# Altium schematic sheet Mainboard_V1.0_Input.SchDoc: Mainboard
size A4; PageSetup: Record=PageOptions|CenterHorizontal=True|CenterVertical=True|PrintScale=0.97|XCorrection=1.00|YCorrection=1.00|PrintKind=0|BorderSize=5000000|LeftOffset=0|BottomOffset=0|Orientation=2|PaperLength=1000|PaperWidth=1000|Scale=100|PaperSource=7|PrintQuality=-3|MediaType=1|DitherType=10|PrintScaleMode=1|PaperKind=A4|PaperIndex=9; Organization: Ostschweizer Fachhochschule; Address2: Florian Baumgartner & Thierry Schwaller; Address3: florian.baumgartner@ost.ch; DocumentNumber: 3; Revision: V1.0; SheetNumber: 3; SheetTotal: 7; Author: Florian Baumgartner & Alain Keller; Subtitle: PDM-Microphone Input
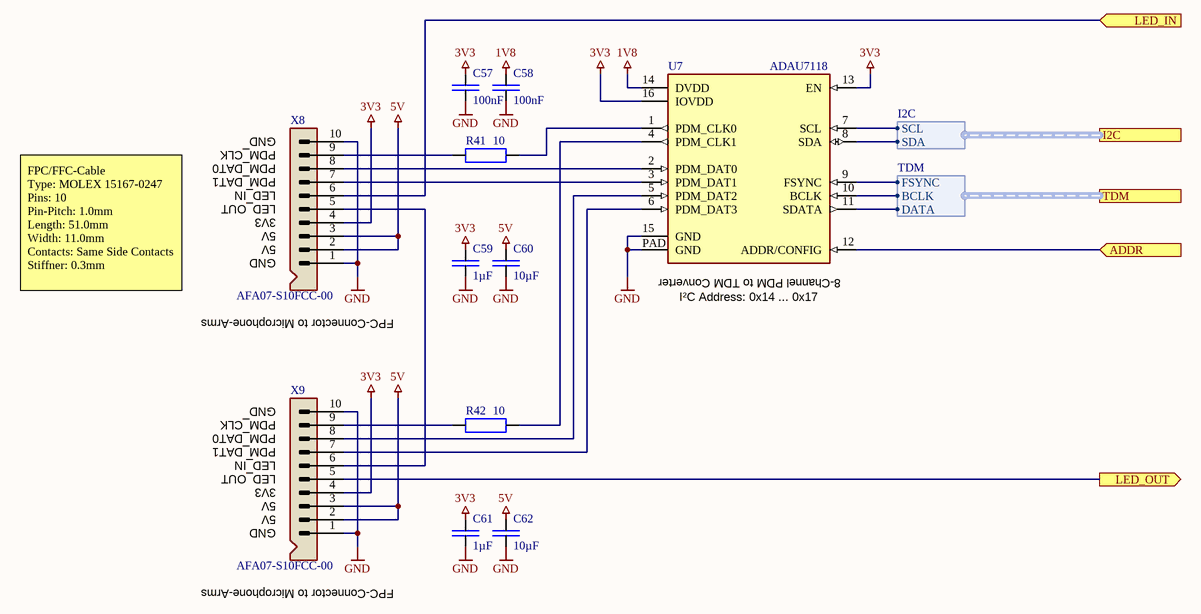
[diagram p0: Mainboard_V1.0_Input.SchDoc]

## Parts
C57  100nF  [SMD Keramikkondensator 0603]
C58  100nF  [SMD Keramikkondensator 0603]
C59  1µF  [SMD Keramikkondensator 0603]
C60  10µF  [SMD Keramikkondensator 1206]
C61  1µF  [SMD Keramikkondensator 0603]
C62  10µF  [SMD Keramikkondensator 1206]
R41  10  [SMD Widerstand 0603]
R42  10  [SMD Widerstand 0603]
U7  ADAU7118  [SMD IC QFN-16]
X8  AFA07-S10FCC-00  [SMD Connector (AFA07-S10FCC-00)]
X9  AFA07-S10FCC-00  [SMD Connector (AFA07-S10FCC-00)]

## Ports
ADDR (in), I2C (harness I2C), LED_IN (in), LED_OUT (out), TDM (harness TDM)

## Harnesses
TDM: BCLK, FSYNC, DATA
I2C: SCL, SDA

## Nets
1V8: C58.2 U7.14(DVDD)
3V3: C57.2 C59.2 C61.2 U7.13(EN) U7.16(IOVDD) X8.4 X9.4
5V: C60.2 C62.2 X8.2 X8.3 X9.2 X9.3
GND: C57.1 C58.1 C59.1 C60.1 C61.1 C62.1 U7.15(GND) U7.PAD(GND) X8.1 X8.10 X9.1 X9.10
ADDR: U7.12(ADDR/CONFIG) ; port ADDR
LED_IN: X8.6 ; port LED_IN
LED_OUT: X9.5 ; port LED_OUT
NetR41_1: R41.1 U7.1(PDM_CLK0)
NetR41_2: R41.2 X8.9
NetR42_1: R42.1 U7.4(PDM_CLK1)
NetR42_2: R42.2 X9.9
NetU7_2: U7.2(PDM_DAT0) X8.8
NetU7_3: U7.3(PDM_DAT1) X8.7
NetU7_5: U7.5(PDM_DAT2) X9.8
NetU7_6: U7.6(PDM_DAT3) X9.7
NetU7_7: U7.7(SCL) ; port I2C.SCL
NetU7_8: U7.8(SDA) ; port I2C.SDA
NetU7_9: U7.9(NC) ; port TDM.FSYNC
NetU7_10: U7.10(NC) ; port TDM.BCLK
NetU7_11: U7.11(NC) ; port TDM.DATA
NetX8_5: X8.5 X9.6

## Notes on the sheet
- (near X8) PDM_CLK
- (near X8) PDM_DAT0
- (near X8) PDM_DAT1
- (near X8) GND
- (near X8) LED_IN
- (near X8) LED_OUT
- (near X8) 5V
- (near X8) 3V3
- FPC/FFC-Cable
  Type: MOLEX 15167-0247
  Pins: 10
  Pin-Pitch: 1.0mm
  Length: 51.0mm
  Width: 11.0mm
  Contacts: Same Side Contacts
  Stiffner: 0.3mm
- Digikey <https://www.digikey.ch/de/products/detail/molex/0151670247/3281500>
- Farnell <https://ch.farnell.com/molex/15167-0247/konf-kabel-10-adrig-51mm-weiss/dp/2096091>
- Mouser <https://www.mouser.ch/ProductDetail/Molex/15167-0247?qs=N2VrfF4LzQc0wWLu7%252Bq4SQ%3D%3D>
- FPC-Connector to Microphone-Arms
- (near U7) 8-Channel PDM to TDM Converter
- (near U7) I²C Address: 0x14 ... 0x17
- (near X9) PDM_CLK
- (near X9) PDM_DAT0
- (near X9) PDM_DAT1
- (near X9) GND
- (near X9) LED_IN
- (near X9) LED_OUT
- (near X9) 5V
- (near X9) 3V3
- Title
- Author:
- Subtitle
- Date:
- Rev:
- File:
- Sheet
- of

## Library data of the parts
C57 C58 = E6 - 100nF: SMD Ceramic Capacitor E6; Component Value: 100nF 50V; Component Description: Multilayer Ceramic Capacitors; ComponentLink1Description: Datasheet; ComponentLink1URL: https://datasheet.lcsc.com/lcsc/1809301912_YAGEO-CC0603KRX7R9BB104_C14663.pdf; Digikey: 445-5666-1-ND; Farnell: 2522432; JLC-Parts: C14663; Mouser: 77-VJ0603V104ZXAPBC; Unit Price: 0.01
C59 C61 = C-CAPACITOR: CAP-MK; Component Description: Multilayer Ceramic Capacitors; Component Value: 1µF 50V; Digikey: 1276-1860-1-ND; Farnell: 3013383; Mouser: 187-CL10A105KB8NNNC; JLC-Parts: C15849; Unit Price: 0.01
C60 C62 = E6 - 10uF: SMD Ceramic Capacitor E6; Component Value: 10µF 50V; Component Description: Multilayer Ceramic Capacitors MLCC; ComponentLink1Description: Datasheet; ComponentLink1URL: https://datasheet.lcsc.com/lcsc/1810191219_Samsung-Electro-Mechanics-CL10A106KP8NNNC_C19702.pdf; Digikey: 587-3258-1-ND; Farnell: 2113070; JLC-Parts: C13585; Mouser: 963-LMK107BBJ106MALT; Unit Price: 0.01
R41 R42 = R-RESISTOR: RES (E=Heizwiderstand B=Messwandler); Component Description: Thick Film Chip Resistor; Component Value: 10 (75V, 100mW, 1%); Digikey: P10.0HCT-ND; Farnell: 2302958; Mouser: 667-ERJ-3EKF10R0V; JLC-Parts: C22859; Unit Price: 0.01
U7 = U-ADAU7118: 8-Channel PDM to I²S/TDM Converter; Component Value: ADAU7118ACPZRL; ComponentLink1Description: Datasheet; ComponentLink1URL: https://www.analog.com/media/en/technical-documentation/data-sheets/ADAU7118.pdf; Digikey: 505-ADAU7118ACPZRLCT-ND; Farnell: 4033291; JLC-Parts: C654437; Mouser: 584-ADAU7118ACPZRL; Unit Price: 6.20; Component Description: 8-Channel PDM to I²S/TDM Converter
X8 X9 = X-FPC-Connector (10-Pin): FPC-Connector (10-Pin, Slide-Lock,  Bottom Contact); Digikey: 2073-FFC3B07-10-TCT-ND; Farnell: 3873345; Mouser: 640-FFC3B07-10-T; Component Description: FPC-Connector (10-Pin, Slide-Lock,  Bottom Contact); Component Value: AFA07-S10FCC-00; JLC-Parts: C52162; Unit Price: 0.09; ComponentLink1Description: Datasheet; ComponentLink1URL: https://datasheet.lcsc.com/lcsc/1811142212_JUSHUO-AFA07-S10FCC-00_C52162.pdf